# Altium schematic sheet mcu.SchDoc: Opo
size Letter; Author: William Huang; Engineer: William Huang; Organization: Altium Limited; Address1: L3, 12a Rodborough Rd; Address2: Frenchs Forest; Address3: NSW; Address4: Australia 2086; Revision: 3.0; PageSetup: Record=PageOptions|CenterHorizontal=True|CenterVertical=True|PrintScale=0.94|XCorrection=1.00|YCorrection=1.00|PrintKind=0|BorderSize=5000000|LeftOffset=0|BottomOffset=0|Orientation=2|PaperLength=1000|PaperWidth=1000|Scale=100|PaperSource=7|PrintQuality=-4|MediaType=1|DitherType=10|PaperKind=Letter|PrintScaleMode=1
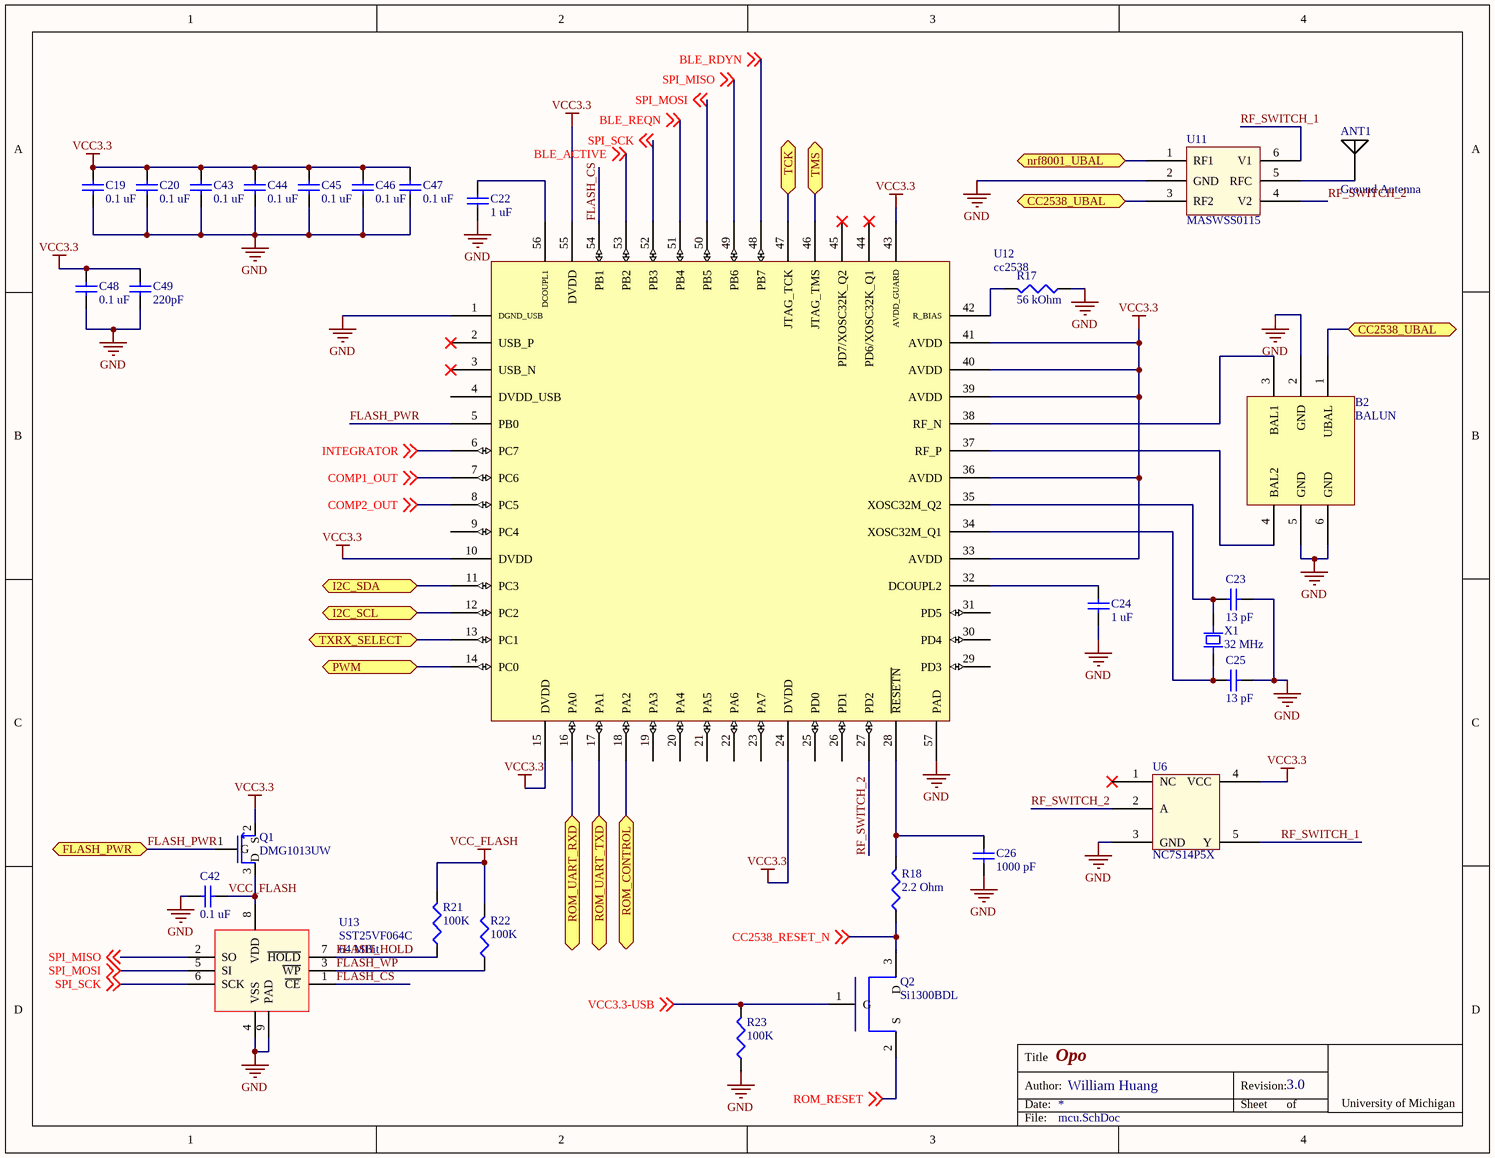
[diagram p0: mcu.SchDoc]

## Parts
ANT1  Ground Antenna  [Chip Antenna]
B2  BALUN  [Chip Balun]
C19  value 0.1 uF  [0402]  (hidden comment: Ceramic capacitor)
C20  value 0.1 uF  [0402]  (hidden comment: Ceramic capacitor)
C22  value 1 uF  [0402]  (hidden comment: Ceramic capacitor)
C23  value 13 pF  [0402]  (hidden comment: 13pf 0402 Cap)
C24  value 1 uF  [0402]  (hidden comment: Ceramic capacitor)
C25  value 13 pF  [0402]  (hidden comment: 13pf 0402 Cap)
C26  value 1000 pF  [0402]  (hidden comment: Ceramic capacitor)
C42  value 0.1 uF  [0402]  (hidden comment: Ceramic capacitor)
C43  value 0.1 uF  [0402]  (hidden comment: Ceramic capacitor)
C44  value 0.1 uF  [0402]  (hidden comment: Ceramic capacitor)
C45  value 0.1 uF  [0402]  (hidden comment: Ceramic capacitor)
C46  value 0.1 uF  [0402]  (hidden comment: Ceramic capacitor)
C47  value 0.1 uF  [0402]  (hidden comment: Ceramic capacitor)
C48  value 0.1 uF  [0402]  (hidden comment: Ceramic capacitor)
C49  value 220pF  [0402]  (hidden comment: 220pF 0402 ceramic cap)
Q1  DMG1013UW  [SC70-3]
Q2  Si1300BDL  [SC70-3]
R17  value 56 kOhm  [0402]  (hidden comment: 56k 0402 Res)
R18  value 2.2 Ohm  [0402]  (hidden comment: 2.2 Ohm 0402 Res)
R21  value 100K  [0402]  (hidden comment: Chip resistor)
R22  value 100K  [0402]  (hidden comment: Chip resistor)
R23  value 100K  [0402]  (hidden comment: Chip resistor)
U6  NC7S14P5X  [SC70-5]
U11  MASWSS0115  [SC70-6]
U12  cc2538  [QFN50P800X800X100_HS-57N]
U13  SST25VF064C  Capacity: 64 MBit  [WSON]
X1  value 32 MHz  [FA-128]  (hidden comment: 32 MHz Crystal)

## Ports
CC2538_UBAL, FLASH_PWR, I2C_SCL, I2C_SDA, nrf8001_UBAL, PWM, ROM_CONTROL, ROM_UART_RXD, ROM_UART_TXD, TCK, TMS, TXRX_SELECT

## Nets
GND: B2.2(GND) B2.5(GND) B2.6(GND) C19.2 C20.2 C22.2 C23.2 C24.2 C25.1 C26.2 C42.1 C43.2 C44.2 C45.2 C46.2 C47.2 C48.2 C49.2 R17.2 R23.2 U6.3(GND) U11.2(GND) U12.1(DGND_USB) U12.57(PAD) U13.4(VSS) U13.9(PAD)
VCC3.3: C19.1 C20.1 C43.1 C44.1 C45.1 C46.1 C47.1 C48.1 C49.1 Q1.2(S) U6.4(VCC) U12.10(DVDD) U12.15(DVDD) U12.24(DVDD) U12.33(AVDD) U12.36(AVDD) U12.39(AVDD) U12.40(AVDD) U12.41(AVDD) U12.43(AVDD_GUARD) U12.55(DVDD)
VCC_FLASH: C42.2 Q1.3(D) R21.1 R22.1 U13.8(VDD)
BLE_ACTIVE: U12.53(PB2) ; off-sheet BLE_ACTIVE
BLE_RDYN: U12.48(PB7) ; off-sheet BLE_RDYN
BLE_REQN: U12.51(PB4) ; off-sheet BLE_REQN
CC2538_RESET_N: Q2.3(D) R18.2 ; off-sheet CC2538_RESET_N
CC2538_UBAL: B2.1(UBAL) U11.3(RF2) ; port CC2538_UBAL
COMP1_OUT: U12.7(PC6) ; off-sheet COMP1_OUT
COMP2_OUT: U12.8(PC5) ; off-sheet COMP2_OUT
FLASH_CS: U12.54(PB1) U13.1(~{CE})
FLASH_HOLD: R21.2 U13.7(~{HOLD})
FLASH_PWR: Q1.1(G) U12.5(PB0) ; port FLASH_PWR
FLASH_WP: R22.2 U13.3(~{WP})
I2C_SCL: U12.12(PC2) ; port I2C_SCL
I2C_SDA: U12.11(PC3) ; port I2C_SDA
INTEGRATOR: U12.6(PC7) ; off-sheet INTEGRATOR
nrf8001_UBAL: U11.1(RF1) ; port nrf8001_UBAL
PWM: U12.14(PC0) ; port PWM
RF_SWITCH_1: U6.5(Y) U11.6(V1)
RF_SWITCH_2: U6.2(A) U11.4(V2) U12.27(PD2)
ROM_CONTROL: U12.18(PA2) ; port ROM_CONTROL
ROM_RESET: Q2.2(S) ; off-sheet ROM_RESET
ROM_UART_RXD: U12.16(PA0) ; port ROM_UART_RXD
ROM_UART_TXD: U12.17(PA1) ; port ROM_UART_TXD
SPI_MISO: U12.49(PB6) U13.2(SO) ; off-sheet SPI_MISO
SPI_MOSI: U12.50(PB5) U13.5(SI) ; off-sheet SPI_MOSI
SPI_SCK: U12.52(PB3) U13.6(SCK) ; off-sheet SPI_SCK
TCK: U12.47(JTAG_TCK) ; port TCK
TMS: U12.46(JTAG_TMS) ; port TMS
TXRX_SELECT: U12.13(PC1) ; port TXRX_SELECT
VCC3.3-USB: Q2.1(G) R23.1 ; off-sheet VCC3.3-USB
NetANT1_1: ANT1.1 U11.5(RFC)
NetB2_3: B2.3(BAL1) U12.38(RF_N)
NetB2_4: B2.4(BAL2) U12.37(RF_P)
NetC22_1: C22.1 U12.56(DCOUPL1)
NetC23_1: C23.1 U12.35(XOSC32M_Q2) X1.1
NetC24_1: C24.1 U12.32(DCOUPL2)
NetC25_2: C25.2 U12.34(XOSC32M_Q1) X1.3
NetC26_1: C26.1 R18.1 U12.28(~{RESETN})
NetR17_1: R17.1 U12.42(R_BIAS)

Not connected (* = marked no-connect by the designer): U6 1(NC)*; U12 2(USB_P)* 3(USB_N)* 4(DVDD_USB) 9(PC4) 19(PA3) 20(PA4) 21(PA5) 22(PA6) 23(PA7) 25(PD0) 26(PD1) 29(PD3) 30(PD4) 31(PD5) 44(PD6/XOSC32K_Q1)* 45(PD7/XOSC32K_Q2)*

## Notes on the sheet
- Title
- Date:
- Author:
- Revision:
- Sheet
- of
- University of Michigan
- File:

## Library data of the parts
ANT1 = Ground Antenna: 2.4GHz Surface Mount Device (SMD) On Ground Antenna, 50 Ohms; Supplier 1: RichardsonRFPD; Supplier Part Number 1: FR05-S1-N-0102B
B2 = cc2538_Balun: Johanson CC253X Balun; Supplier 1: Digikey; Supplier Part Number 1: 712-1536-1-ND
C19 C20 C42-C48 = C_0.1u_0402_ceramic: Ceramic capacitor, 0.1u, 0402 package; Manufacture: TDK; voltage rated: 10 V; tolerance: 10%; Supplier 1: Digi-Key; Supplier Part Number 1: 445-1265-1-ND; package: 0402
C22 C24 = C_1u_0402_ceramic: Ceramic capacitor, 1 uF, 0402 package; Manufacture: TDK; voltage rated: 6.3 V; tolerance: 10%; package: 0402; Supplier 1: Digi-Key; Supplier Part Number 1: 445-5000-1-ND
C23 C25 = C_13p_0402: 13pf, 50V, 2%, c0G, NP0, 0402, ceramic; Mfr: Murata; Mfr Part Number: GRM1555C1H130GA01D; Supplier 1: Digikey; Supplier Part Number 1: 490-8184-1-ND
C26 = C_1000p_0402_ceramic: Ceramic capacitor, 1000 pF, 0402 package; Manufacture: TDK; voltage rated: 50 V; tolerance: 10%; package: 0402; Supplier 1: Digi-Key; Supplier Part Number 1: 445-6846-1-ND
C49 = C_220pf_0402_ceramic: 220pF 5% 50 V C0G NP0 0402 ceramic cap; Mfr: Murata; Mfr Part Number: GRM1555C1H221JA01D; Supplier 1: Digikey; Supplier Part Number 1: 490-1293-1-ND
Q1 = DMG1013UW: P-CHANNEL ENHANCEMENT MODE MOSFET; Supplier 1: Digi-Key; Supplier Part Number 1: DMG1013UW-7DICT-ND
Q2 = Si1300BDL: MOSFET N-CH D-S 20V SC-70-3; Supplier 1: Digi-Key; Supplier Part Number 1: SI1300BDL-T1-GE3CT-ND
R17 = R_56K_0402: 56 kOhm, 1%, .0603 W, 0402; Mfr: Rohm; Mfr Part Number: MCR01MRTF5602; Supplier 1: Digikey; Supplier Part Number 1: RHM56.0KCDCT-ND
R18 = R_2.2_0402: 2.2 Ohm, 1%, .063W, 0402; Mfr: Vishay Dale; Mfr Part Number: CRCW04022R20FKED; Supplier 1: Digikey; Supplier Part Number 1: 541-2.20LLCT-ND
R21-R23 = R_100K_0402: Chip resistor, 100K, 0402 package; tolerance: 1%; power: 1/16 W; Supplier 1: Digi-Key; Supplier Part Number 1: 541-100KLCT-ND; package: 0402
U6 = NC7S14P5X: Single Inverter; Mfr: Fairchild; Mfr Part Number: NC7S14P5X; Supplier 1: Digikey; Supplier Part Number 1: NC7S14P5XDKR-ND
U11 = MASWSS0115: Rf Switch; Mfr: M/A-Com; Mfr Part Number: MASWSS0115TR-3000; Supplier 1: Digikey; Supplier Part Number 1: 1465-1373-1-ND
U12 = cc2538: cc2538 MCU/802.15.4 radio; Supplier 1: Digikey; Supplier Part Number 1: 296-35797-1-ND
U13 = SST25VF064C: 64 Mbit SPI Serial Dual I/O Flash; Supplier 1: Digi-Key; Supplier Part Number 1: SST25VF064C-80-4I-Q2AE-CT-ND
X1 = X_32M_FA-128: 32MHz, 10ppm, 10pF, 60 Ohm; Mfr: Epson; Mfr Part Number: FA-128 32.0000MF20X-K3; Supplier 1: Digikey; Supplier Part Number 1: SER3800CT-ND